# EAGLE design attiny1l (EAGLE 6.2)
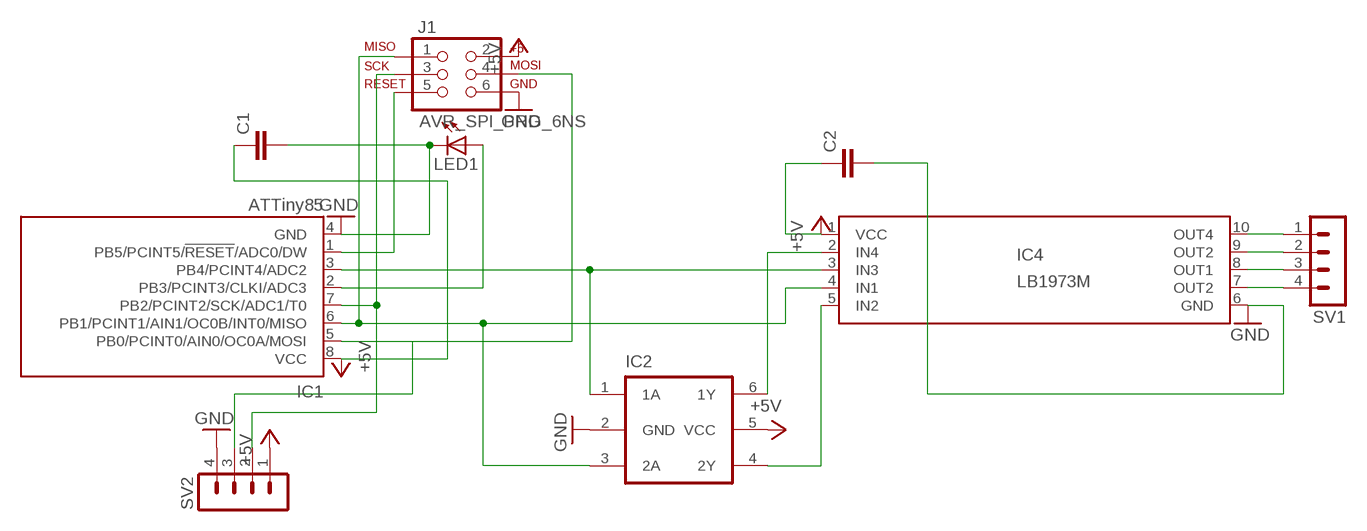
[diagram p0: schematic, sheet 1]

## Parts
C1  C-EUC0805  [C0805]
C2  C-EUC0805  [C0805]
IC1  ATTiny85  TINY13-20SU  [8S2]
IC2  IC_BUFF_SN74LVC2G17DBV  [DBV-R-PDSO-G6]
IC4  LB1973M  [SSOP10]
J1  AVR_SPI_PRG_6NS  [2X3-NS]
LED1  LED0603  [LED-0603]
SV1  MA04-1  [MA04-1]
SV2  MA04-1  [MA04-1]

## Nets
+5V: C1.1 C2.1 IC1.8(VCC) IC2.5(VCC) IC4.1(VCC) J1.2 SV2.1
GND: C1.2 C2.2 IC1.4(GND) IC2.2(GND) IC4.6(GND) J1.6 LED1.C SV2.4
IN1/MISO: IC1.6(PB1/PCINT1/AIN1/OC0B/INT0/MISO) IC2.3(2A) IC4.4(IN1) J1.1
IN2: IC2.4(2Y) IC4.5(IN2)
N$1: IC1.3(PB4/PCINT4/ADC2) IC2.1(1A) IC4.3(IN3)
N$2: IC2.6(1Y) IC4.2(IN4)
N$3: IC1.2(PB3/PCINT3/CLKI/ADC3) LED1.A
N$6: IC1.1(PB5/PCINT5/!RESET!/ADC0/DW) J1.5
OUT1: IC4.8(OUT1) SV1.3
OUT2: IC4.7(OUT2) SV1.4
OUT3: IC4.9(OUT2) SV1.2
OUT4: IC4.10(OUT4) SV1.1
SCL/SCK: IC1.7(PB2/PCINT2/SCK/ADC1/T0) J1.3 SV2.2
SDA/MOSI: IC1.5(PB0/PCINT0/AIN0/OC0A/MOSI) J1.4 SV2.3

## Library data of the parts
C1 C2 = rcl:C-EU: CAPACITOR, European symbol
IC1 = atmel:TINY13: 8-bit AVR Microcontroller with 1K Bytes In-System Programmable Flash Source: http://www.atmel.com/dyn/resources/prod_documents/2535S.pdf; MPN: ATTINY13-20SU; OC_FARNELL: 9171568; OC_NEWARK: 96K6522
IC2 = dp_devices:IC_BUFF_SN74LVC2G17
IC4 = LB1973M:LB1973M: edit this description Auto generated by make-symbol-device-package-bsdl.ulp Rev. 43 Source:
J1 = SparkFun-Connectors:AVR_SPI_PRG_6: AVR ISP 6 Pin This is the reduced ISP connector for AVR programming. Common on Arduino. This footprint will take up less PCB space and can be used with a 10-pin to 6-pin adapter such as SKU: BOB-08508
LED1 = SparkFun-LED:LED: LEDs Standard schematic elements and footprints for 5mm, 3mm, 1206, and 0603 sized LEDs. 5mm - Spark Fun Electronics SKU : COM-00529 (and others)
SV1 SV2 = con-lstb:MA04-1: PIN HEADER; OC_FARNELL: unknown; OC_NEWARK: unknown

## Board
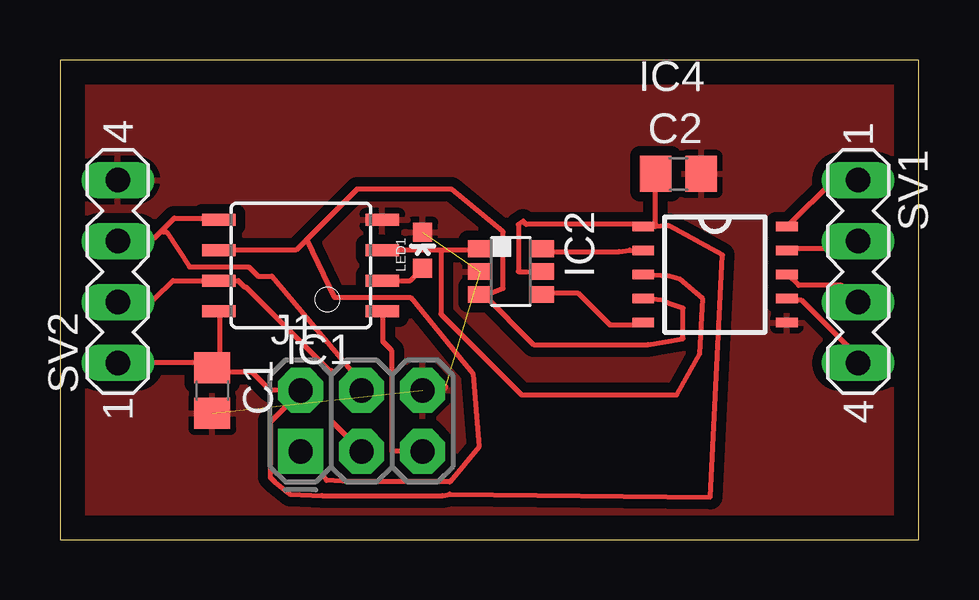
[diagram p1: board, top side]

Size 35.79 x 19.99 mm. Coordinates in mm from the lower left corner, seen from the top.
Outline: 0,0 35.79,0 35.79,19.99 0,19.99 0,0
Copper layers 1: Top 0.035mm
Design rules: minimum track width 8mil, minimum drill 24mil, track to track 8mil, track to pad 8mil, pad to pad 8mil, via to via 8mil, smd to smd 8mil, copper to edge 40mil, drill to drill 8mil, minimum pad ring 10mil, minimum via ring 8mil, stop-mask expansion 4mil, vias tented up to drill 0mil, thermal gap 10mil

### Footprints (pad centres in the part's own frame; a part is rotated, then mirrored left to right if it is on the bottom)
C0805 = smd 1.3 x 1.5: 1 -0.95,0; 2 0.95,0
8S2 = smd 0.5 x 1.4: 1 -1.905,-3.404; 2 -0.645,-3.404; 3 0.625,-3.404; 4 1.895,-3.404; 5 1.905,3.404; 6 0.635,3.404; 7 -0.635,3.404; 8 -1.905,3.404
DBV-R-PDSO-G6 = smd 0.69 x 0.99: 1 -0.95,-1.29; 2 0,-1.29; 3 0.95,-1.29; 4 0.95,1.3; 5 0,1.3; 6 -0.95,1.3
SSOP10 = smd 0.9 x 0.4: 1 -2.996,2; 2 -2.996,1; 3 -2.996,0; 4 -2.996,-1; 5 -2.996,-2; 6 2.996,-2; 7 2.996,-1; 8 2.996,0; 9 2.996,1; 10 2.996,2
2X3-NS = drill 1.016 pad 1.88 square: 1 -2.54,-1.27 | drill 1.016 pad 1.88 octagon: 2 -2.54,1.27; 3 0,-1.27; 4 0,1.27; 5 2.54,-1.27; 6 2.54,1.27
LED-0603 = smd 0.8 x 0.8: A 0,-0.75; C 0,0.75
MA04-1 = drill 1.016 long: 1 -3.81,0; 2 -1.27,0; 3 1.27,0; 4 3.81,0

### Placement (x,y rotation side)
C1  6.35,6.22 270 top
C2  25.78,15.24 0 top
IC1  10.03,11.43 90 top
IC2  18.8,11.18 270 top
IC4  27.3,11.05 0 top
J1  12.57,4.95 0 top
LED1  15.11,12.06 0 top
SV1  33.27,11.18 270 top
SV2  2.41,11.18 90 top

### Tracks (layer width: path | path; a pad name or v marks a point on that pad's centre or on a via)
+5V
  Top 0.203: 24.26,13.08 IC4.1 | IC2.5 19.11,11.18 19.11,13.14 19.3,13.27 19.43,13.14 24.19,13.14 IC4.1 | IC1.8 6.67,9.53 6.67,7.18 C1.1 | C1.1 6.73,7.11 6.86,6.99 8,6.99 8.76,6.22 J1.2 10.03,6.16 8.83,4.95 8.76,4.95 8.76,2.6 8.95,2.41 9.59,1.91 10.92,1.84 15.94,1.84 16.26,1.91 27.11,1.78 27.62,11.87 25.4,13.08 25.21,13.08 24.84,13.05 | SV2.1 6.6,7.37 C1.1 | 24.84,13.05 24.38,13.02 IC4.1 | C2.1 24.83,13.14 24.84,13.05
GND  (3 unrouted)
  Top 0.203: 15.68,6.33 15.68,6.41 J1.6 | 16.07,6.41 16.07,6.33 | IC4.6 30.35,9.08 IC4.6 | IC4.6 30.29,9.08 IC4.6
  pour Top (isolate 0.406): 0,19.94 0,0 35.81,0 35.81,19.94
IN1/MISO
  Top 0.203: IC4.4 24.32,10.03 25.15,9.97 25.4,9.84 25.97,9.65 25.97,8.38 24.51,8.13 19.75,8.13 17.65,10.22 17.53,10.22 IC2.3 17.78,10.22 17.84,10.22 18.48,10.48 18.48,12.83 16.32,14.61 12.38,14.61 10.29,12.51 | IC1.6 9.84,12.06 10.29,12.51 | J1.1 10.86,2.86 11.11,2.48 12.06,2.41 16.26,2.41 17.46,3.87 17.21,6.92 16.89,7.3 14.61,10.1 11.43,10.1 10.29,12.51
IN2
  Top 0.203: IC4.5 24.26,9.02 24.19,8.95 22.92,8.95 21.59,10.29 20.13,10.29 IC2.4
N$1
  Top 0.203: 15.88,12.06 15.88,9.4 19.24,6.03 25.72,6.03 26.67,7.75 26.8,10.03 25.84,10.86 25.4,10.99 IC4.3 | 15.88,12.06 17.46,12.06 IC2.1 | 15.88,12.06 13.46,12.06 IC1.3
N$2
  Top 0.203: IC4.2 23.75,12.06 23.3,12 20.19,12 20.13,12.06 IC2.6
N$3
  Top 0.203: LED1.A 14.61,10.79 13.46,10.79 IC1.2
N$6
  Top 0.203: J1.5 13.84,3.68 13.84,7.87 13.46,8.26 13.46,9.53 IC1.1
OUT1
  Top 0.203: SV1.3 32.58,10.6 30.8,10.6 30.35,11.05 IC4.8
OUT2
  Top 0.203: SV1.4 33.27,7.62 30.92,9.97 30.42,9.97 30.35,10.03 IC4.7
OUT3
  Top 0.203: SV1.2 32.96,12.13 30.42,12.13 30.35,12.06 IC4.9
OUT4
  Top 0.203: SV1.1 32.26,14.99 30.35,13.08 IC4.10
SCL/SCK
  Top 0.203: SV2.2 2.54,10.03 3.94,10.03 4.7,10.79 IC1.7 7.43,10.79 7.68,10.54 7.75,10.54 11.24,7.05 11.3,7.05 11.3,4.95 J1.3
SDA/MOSI
  Top 0.203: 4.25,12.89 3.94,12.57 2.54,12.57 SV2.3 | 4.25,12.89 4.76,13.4 6.54,13.4 6.6,13.34 IC1.5 | J1.4 12.57,7.05 12.13,7.05 8.83,10.99 8.26,10.99 7.87,11.37 5.4,11.37 4.45,12.83 4.32,12.83 4.25,12.89